# EAGLE design MouseBox_PortBreakout_SMT_r1 (EAGLE 6.3)
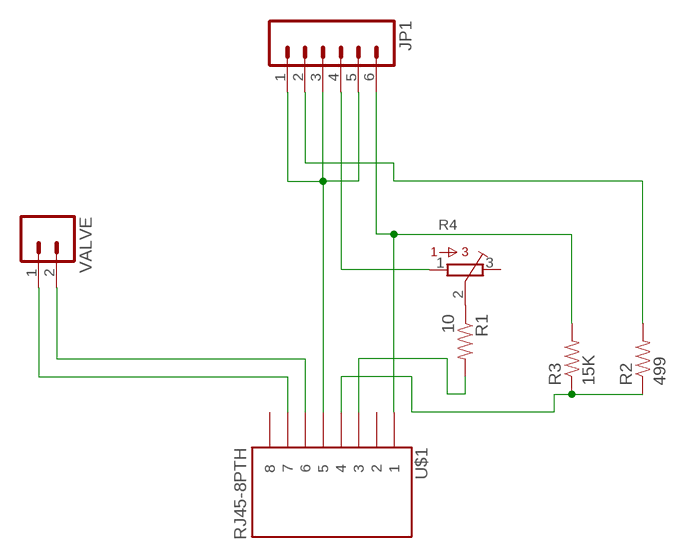
[diagram p0: schematic, sheet 1]

## Parts
JP1  M063.5MM-6  [SCREWTERMINAL-3.5MM-6]
R1  10  RESISTOR1206  [1206]
R2  499  RESISTOR1206  [1206]
R3  15K  RESISTOR1206  [1206]
R4  3362R  [3362R]
U$1  RJ45-8PTH  [RJ45-8]
VALVE  M023.5MM_LOCK  [SCREWTERMINAL-3.5MM-2_LOCK]

## Nets
GND: JP1.1 JP1.3 JP1.5 U$1.5
N$1: JP1.6 R3.2 U$1.1
N$2: R2.1 R3.1 U$1.4
N$3: JP1.2 R2.2
N$4: R1.1 R4.2
N$5: U$1.6 VALVE.2
N$6: U$1.7 VALVE.1
N$7: JP1.4 R4.1
N$8: R1.2 U$1.3
Unconnected: R4.3 U$1.2 U$1.8

## Library data of the parts
JP1 = SparkFun:M06: Header 6 Standard 6-pin 0.1" header. Use with straight break away headers (SKU : PRT-00116), right angle break away headers (PRT-00553), swiss pins (PRT-00743), machine pins (PRT-00117), and female headers (PRT-00115). Molex polarized connector foot print use with SKU : PRT-08094 with associated crimp pins and housings. NOTES ON THE VARIANTS LOCK and LOCK_LONGPADS... This footprint was designed to help hold the alignment of a through-hole component (i.e. 6-pin header) while soldering it into place. You may notice that each hole has been shifted either up or down by 0.005 of an inch from it's more standard position (which is a perfectly straight line). This slight alteration caused the pins (the squares in the middle) to touch the edges of the holes. Because they are alternating, it causes a "brace" to hold the component in place. 0.005 has proven to be the perfect amount of "off-center" position when using our standard breakaway headers. Although looks a little odd when you look at the bare footprint, once you have a header in there, the alteration is very hard to notice. Also, if you push a header all the way into place, it is covered up entirely on the bottom side. This idea of altering the position of holes to aid alignment will be further integrated into the Sparkfun Library for other footprints. It can help hold any component with 3 or more connection pins.
R1-R3 = SparkFun-Resistors:RESISTOR: Resistor Basic schematic elements and footprints for 0603, 1206, and PTH resistors.
R4 = bourns:3362: 3362 Series 1/4" Square Trimmer
U$1 = SparkFun:RJ45-8: RJ45 Jack Simple RJ45, 8-pin connection - connector for common Cat5, Cat5e, and Cat6 Ethernet cables. Footprint not yet proven in production. Connector sku is PRT-00643; Breakout PCB sku is BOB-00716.
VALVE = SparkFun:M02: Header 2 Standard 2-pin 0.1" header. Use with straight break away headers (SKU : PRT-00116), right angle break away headers (PRT-00553), swiss pins (PRT-00743), machine pins (PRT-00117), and female headers (PRT-00115). Molex polarized connector foot print use with SKU : PRT-08233 with associated crimp pins and housings.

## Board
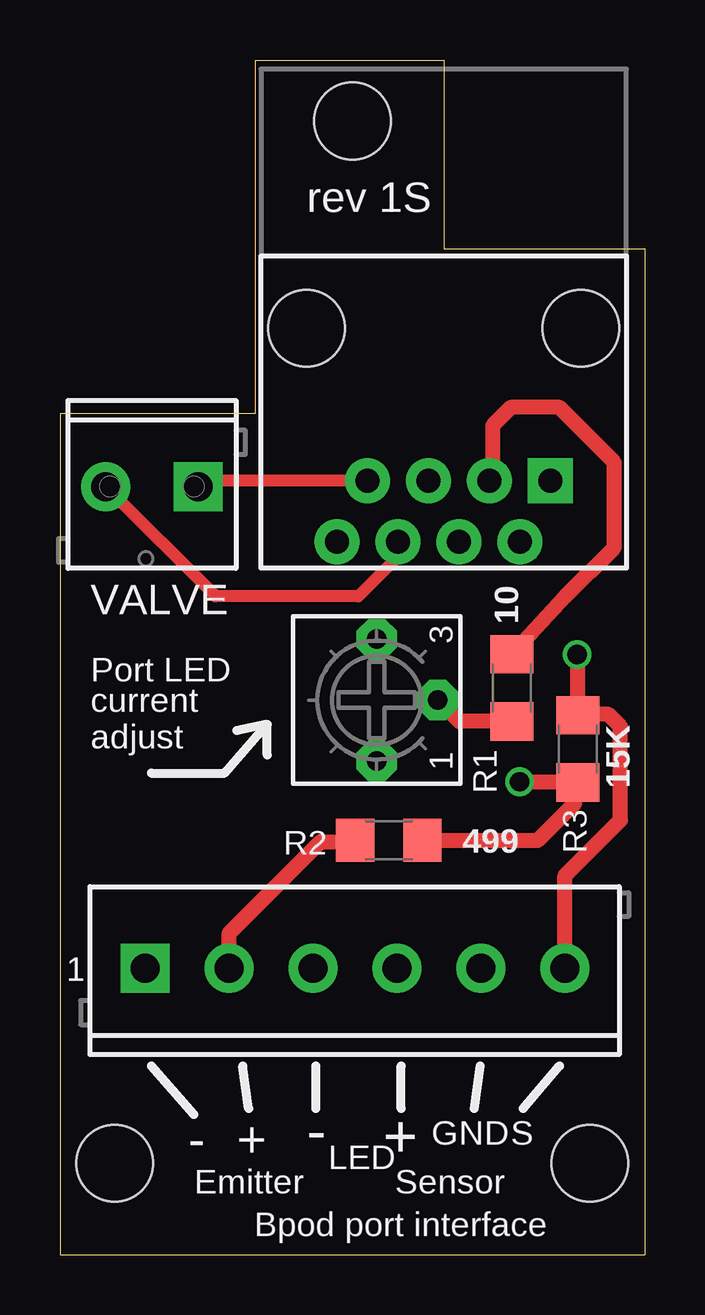
[diagram p1: board, top side]
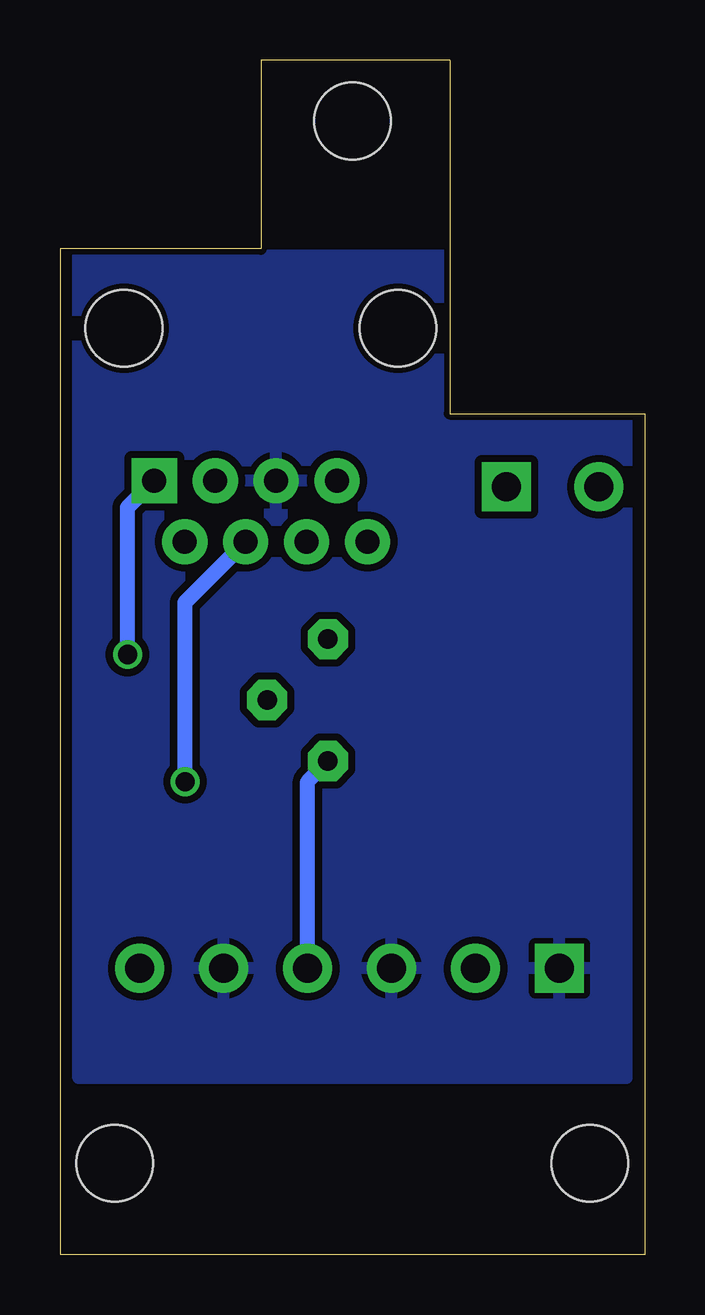
[diagram p2: board, bottom side, seen from below]

Size 24.38 x 49.78 mm. Coordinates in mm from the lower left corner, seen from the top.
Outline: 0,0 24.38,0 24.38,41.91 16,41.91 16,49.78 8.13,49.78 8.13,35.05 0,35.05 0,0
Copper layers (1*16): Top 0.035mm / dielectric 1.5mm / Bottom 0.035mm
Design rules "SeeedStudio_2layer_DRU_no_angle_20140221 *": minimum track width 6mil, minimum drill 12mil, track to track 12mil, track to pad 12mil, pad to pad 12mil, via to via 12mil, smd to smd 0mil, copper to edge 10mil, drill to drill 10mil, minimum pad ring 10mil, minimum via ring 6mil, stop-mask expansion 2mil, vias tented up to drill 100mil, thermal gap 10mil
Holes 3.2 mm at 12.19,47.24 22.1,3.81 2.29,3.81

### Footprints (pad centres in the part's own frame; a part is rotated, then mirrored left to right if it is on the bottom)
SCREWTERMINAL-3.5MM-6 = drill 1.2 pad 2.032 square: 1 0,0 | drill 1.2 pad 2.032: 2 3.5,0; 3 7,0; 4 10.5,0; 5 14,0; 6 17.5,0
1206 = smd 1.6 x 1.8: 1 -1.4,0; 2 1.4,0
3362R = drill 0.813 pad 1.676 octagon: 1 -2.54,0; 2 0,-2.54; 3 2.54,0
RJ45-8 = drill 1 pad 1.88 square: 1 -4.445,6.35 | drill 1 pad 1.88: 2 -3.175,8.89; 3 -1.905,6.35; 4 -0.635,8.89; 5 0.635,6.35; 6 1.905,8.89; 7 3.175,6.35; 8 4.445,8.89 | hole 3.2: -5.715,0; 5.715,0
SCREWTERMINAL-3.5MM-2_LOCK = drill 1.2 pad 2.032 square: 1 -0.178,0 | drill 1.2 pad 2.032: 2 3.678,0

### Placement (x,y rotation side)
JP1  3.56,11.94 0 top
R1  18.84,23.62 90 top
R2  13.72,17.27 180 top
R3  21.59,21.08 90 top
R4  13.21,23.11 90 top
U$1  16,38.61 180 top
VALVE  5.59,32 180 top

### Tracks (layer width: path | path; a pad name or v marks a point on that pad's centre or on a via)
GND
  pour Bottom: 0.76,7.37 23.62,7.37 23.62,41.66 0.76,41.66
N$1  (via drill 0.8)
  Top 0.635: v21.57,25.01 21.59,24.99 R3.2 21.62,22.51 22.87,22.51 23.37,22.01 23.37,18.11 21.06,15.8 JP1.6
  Bottom 0.635: v21.57,25.01 21.57,31.14 U$1.1
N$2  (via drill 0.8)
  Top 0.635: R2.1 19.92,17.27 21.47,18.81 21.47,19.56 R3.1 19.2,19.68 v19.17,19.71
  Bottom 0.635: v19.17,19.71 19.17,27.19 U$1.4
N$3
  Top 0.635: JP1.2 7.06,13.4 10.87,17.21 12.26,17.21 R2.2
N$4
  Top 0.635: R1.1 16.64,22.22 R4.2
N$5
  Top 0.508: U$1.6 14.1,29.08 12.45,27.43 6.48,27.43 VALVE.2
N$6
  Top 0.508: U$1.7 5.77,32.26 VALVE.1
N$7
  Bottom 0.635: JP1.4 14.06,19.73 R4.1
N$8
  Top 0.635: R1.2 21.08,27.43 23.11,29.46 23.11,33.02 20.83,35.31 18.8,35.31 18.03,34.54 18.03,32.39 U$1.3

### Text on the board
tPlace: rev 1S | Port LED | current | adjust | 1 | GND | S | - | + | - | LED | + | Emitter | Sensor | Bpod port interface